# Altium schematic sheet 02_PWR IN.SchDoc (part 1 of 3)
size A3; SheetNumber: 3; SheetTotal: 24
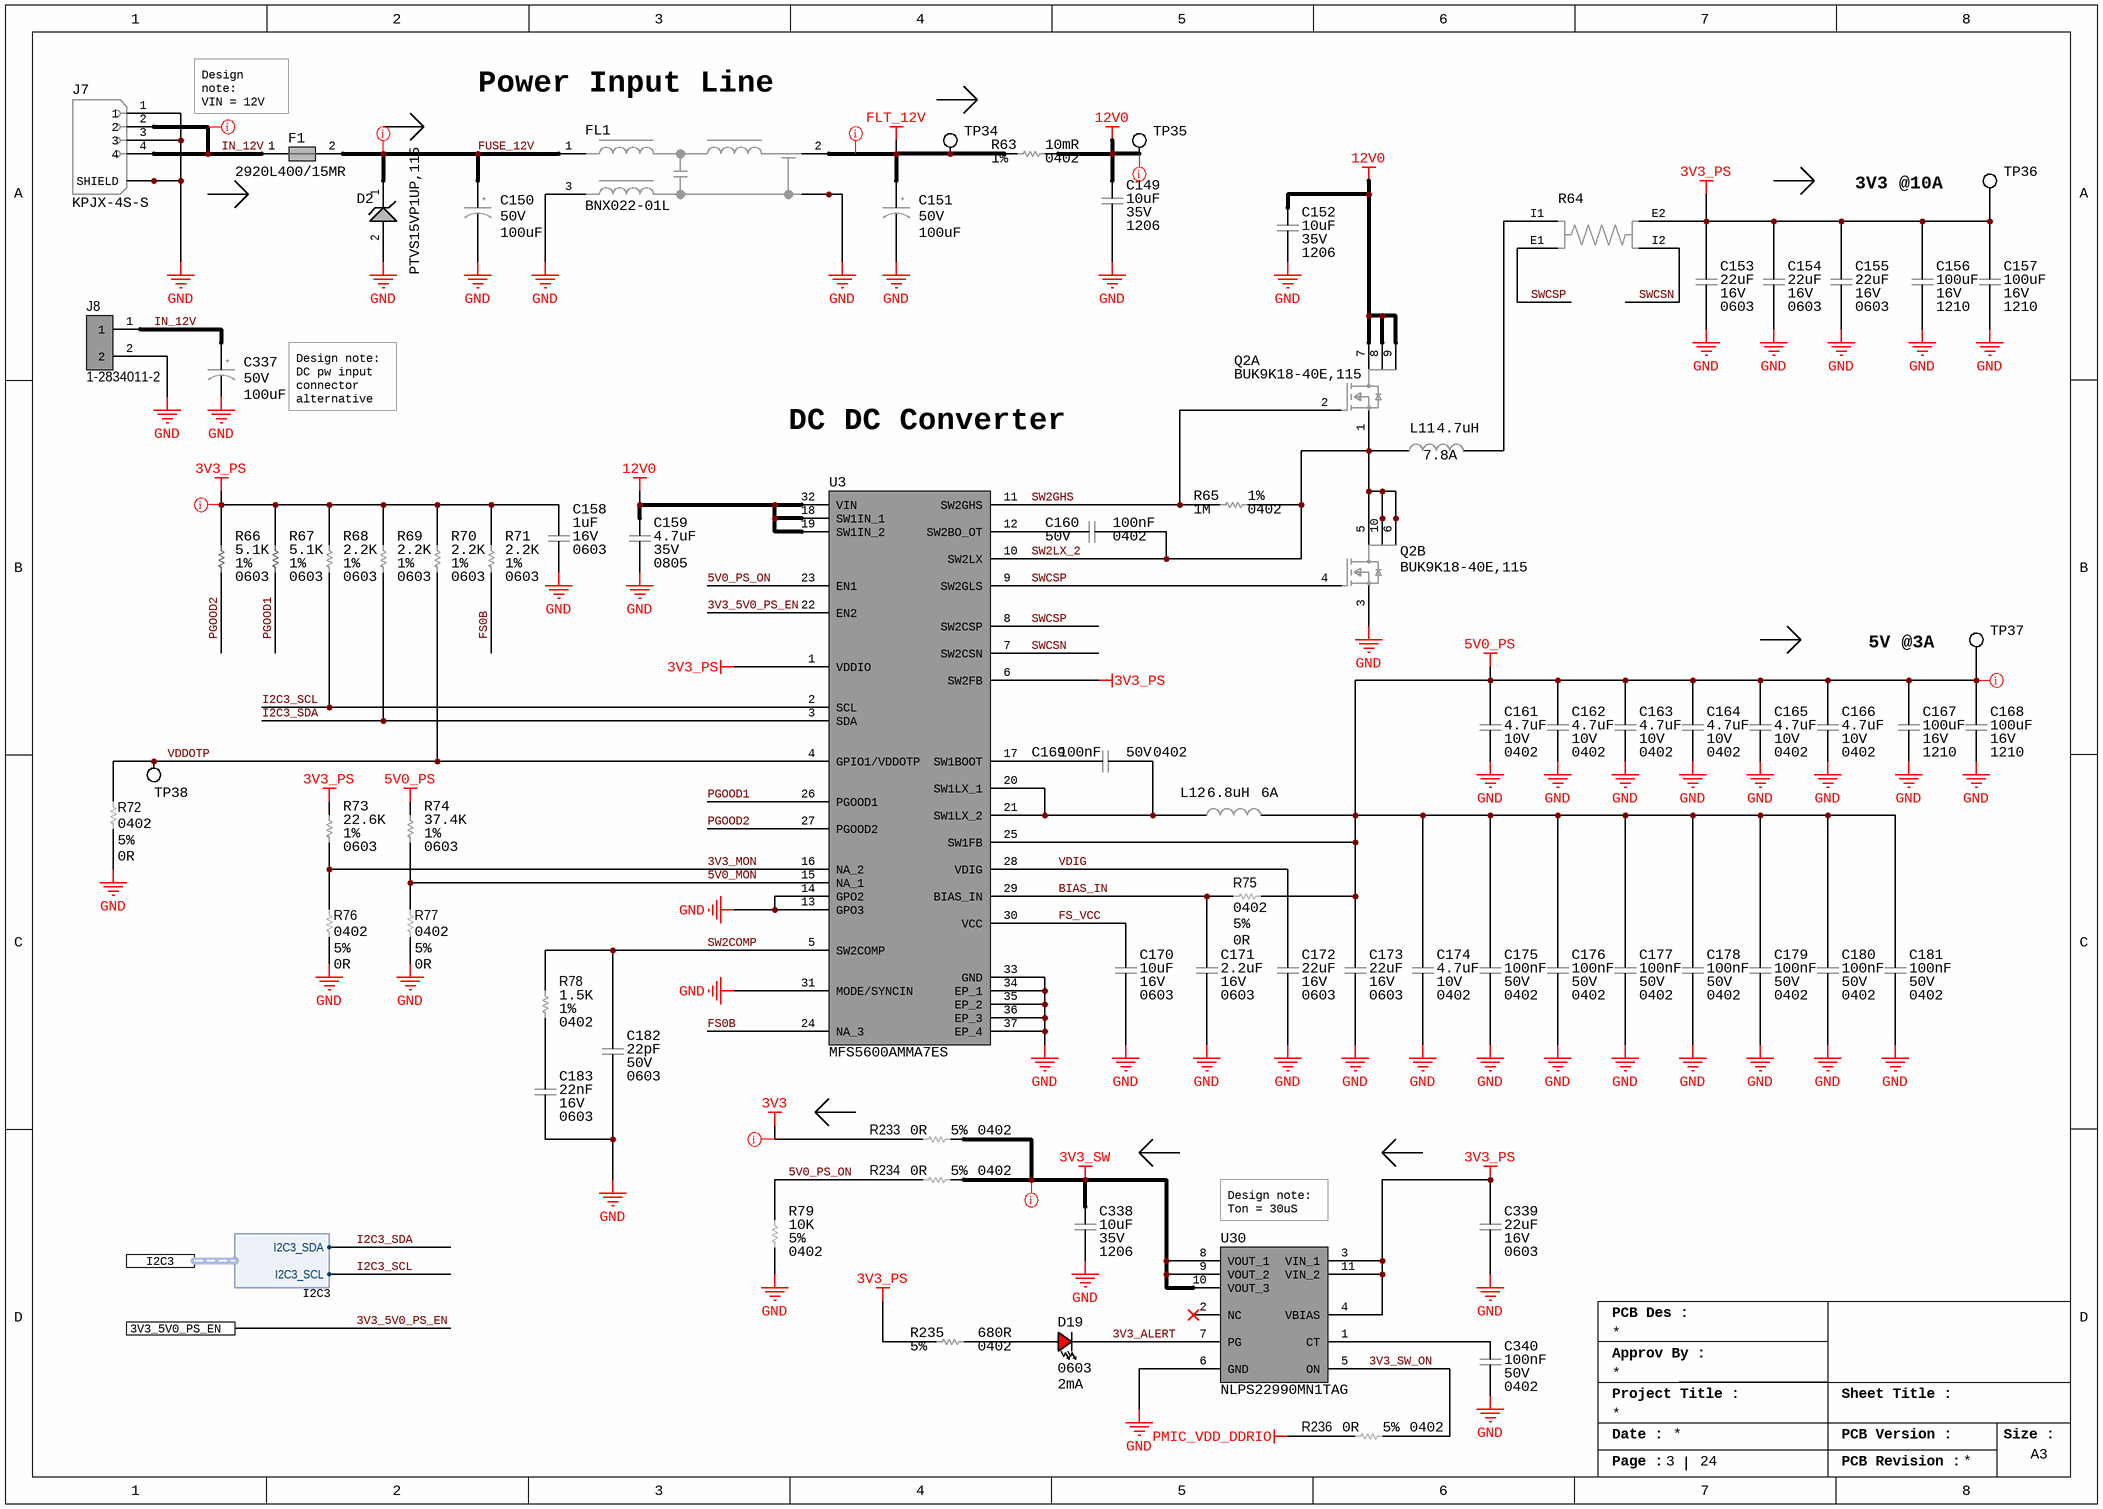
[diagram p0: 02_PWR IN.SchDoc]

## Parts
C149  Voltage Rating: 35V  Capacitance: 10uF  Case/Package: 1206  [CAP_1206_CAPC3216X16N]  (hidden comment: GRM319R6YA106KA12D)
C150  Voltage Rating (DC): 50V  Capacitance: 100uF  [CAP_POLA_UD(8X10)]  (hidden comment: UUD1H101MNL1GS)
C151  Voltage Rating (DC): 50V  Capacitance: 100uF  [CAP_POLA_UD(8X10)]  (hidden comment: UUD1H101MNL1GS)
C152  Voltage Rating: 35V  Capacitance: 10uF  Case/Package: 1206  [CAP_1206_CAPC3216X16N]  (hidden comment: GRM319R6YA106KA12D)
C153  Capacitance: 22uF  Voltage Rating: 16V  Case/Package: 0603  [CAP_0603_CAPC1608X08N]  (hidden comment: CL10A226MO7JZNC)
C154  Capacitance: 22uF  Voltage Rating: 16V  Case/Package: 0603  [CAP_0603_CAPC1608X08N]  (hidden comment: CL10A226MO7JZNC)
C155  Capacitance: 22uF  Voltage Rating: 16V  Case/Package: 0603  [CAP_0603_CAPC1608X08N]  (hidden comment: CL10A226MO7JZNC)
C156  Voltage Rating: 16V  Capacitance: 100uF  Case/Package: 1210  [CAP_1210_CAPC3225X270N]  (hidden comment: EMK325ABJ107MM-T)
C157  Voltage Rating: 16V  Capacitance: 100uF  Case/Package: 1210  [CAP_1210_CAPC3225X270N]  (hidden comment: EMK325ABJ107MM-T)
C158  Voltage Rating: 16V  Capacitance: 1uF  Case/Package: 0603  [CAP_0603_CAPC1608X08N]  (hidden comment: CL10A105KO8NNNC)
C159  Voltage Rating: 35V  Capacitance: 4.7uF  Case/Package: 0805  [CAP_0805_CAPC2012X12N]  (hidden comment: CL21A475KLCLQNC)
C160  Voltage Rating: 50V  Capacitance: 100nF  Case/Package: 0402  [CAP_0402_CAPC1005X05N]  (hidden comment: GRM155R71H104KE14D)
C161  Capacitance: 4.7uF  Voltage Rating: 10V  Case/Package: 0402  [CAP_0402_CAPC1005X05N]  (hidden comment: CL05A475KP5NRNC)
C162  Capacitance: 4.7uF  Voltage Rating: 10V  Case/Package: 0402  [CAP_0402_CAPC1005X05N]  (hidden comment: CL05A475KP5NRNC)
C163  Capacitance: 4.7uF  Voltage Rating: 10V  Case/Package: 0402  [CAP_0402_CAPC1005X05N]  (hidden comment: CL05A475KP5NRNC)
C164  Capacitance: 4.7uF  Voltage Rating: 10V  Case/Package: 0402  [CAP_0402_CAPC1005X05N]  (hidden comment: CL05A475KP5NRNC)
C165  Capacitance: 4.7uF  Voltage Rating: 10V  Case/Package: 0402  [CAP_0402_CAPC1005X05N]  (hidden comment: CL05A475KP5NRNC)
C166  Capacitance: 4.7uF  Voltage Rating: 10V  Case/Package: 0402  [CAP_0402_CAPC1005X05N]  (hidden comment: CL05A475KP5NRNC)
C167  Voltage Rating: 16V  Capacitance: 100uF  Case/Package: 1210  [CAP_1210_CAPC3225X270N]  (hidden comment: EMK325ABJ107MM-T)
C168  Voltage Rating: 16V  Capacitance: 100uF  Case/Package: 1210  [CAP_1210_CAPC3225X270N]  (hidden comment: EMK325ABJ107MM-T)
C169  Voltage Rating: 50V  Capacitance: 100nF  Case/Package: 0402  [CAP_0402_CAPC1005X05N]  (hidden comment: GRM155R71H104KE14D)
C170  Voltage Rating: 16V  Capacitance: 10uF  Case/Package: 0603  [CAP_0603_CAPC1608X08N]  (hidden comment: GRM188R61C106MAALD)
C171  Case/Package: 0603  Capacitance: 2.2uF  Voltage Rating: 16V  [CAP_0603_CAPC1608X08N]  (hidden comment: EMK107BB7225KA-T)
C172  Capacitance: 22uF  Voltage Rating: 16V  Case/Package: 0603  [CAP_0603_CAPC1608X08N]  (hidden comment: CL10A226MO7JZNC)
C173  Capacitance: 22uF  Voltage Rating: 16V  Case/Package: 0603  [CAP_0603_CAPC1608X08N]  (hidden comment: CL10A226MO7JZNC)
C174  Capacitance: 4.7uF  Voltage Rating: 10V  Case/Package: 0402  [CAP_0402_CAPC1005X05N]  (hidden comment: CL05A475KP5NRNC)
C175  Voltage Rating: 50V  Capacitance: 100nF  Case/Package: 0402  [CAP_0402_CAPC1005X05N]  (hidden comment: GRM155R71H104KE14D)
C176  Voltage Rating: 50V  Capacitance: 100nF  Case/Package: 0402  [CAP_0402_CAPC1005X05N]  (hidden comment: GRM155R71H104KE14D)
C177  Voltage Rating: 50V  Capacitance: 100nF  Case/Package: 0402  [CAP_0402_CAPC1005X05N]  (hidden comment: GRM155R71H104KE14D)
C178  Voltage Rating: 50V  Capacitance: 100nF  Case/Package: 0402  [CAP_0402_CAPC1005X05N]  (hidden comment: GRM155R71H104KE14D)
C179  Voltage Rating: 50V  Capacitance: 100nF  Case/Package: 0402  [CAP_0402_CAPC1005X05N]  (hidden comment: GRM155R71H104KE14D)
C180  Voltage Rating: 50V  Capacitance: 100nF  Case/Package: 0402  [CAP_0402_CAPC1005X05N]  (hidden comment: GRM155R71H104KE14D)
C181  Voltage Rating: 50V  Capacitance: 100nF  Case/Package: 0402  [CAP_0402_CAPC1005X05N]  (hidden comment: GRM155R71H104KE14D)
C182  Voltage Rating (DC): 50V  Capacitance: 22pF  Case/Package: 0603  [CAP_0603_CAPC1608X08N]  (hidden comment: C0603C220J5GACTU)
C183  Voltage Rating (DC): 16V  Capacitance: 22nF  Case/Package: 0603  [CAP_0603_CAPC1608X08N]  (hidden comment: C0603C223K4RACTU)
C337  Voltage Rating (DC): 50V  Capacitance: 100uF  [CAP_POLA_UD(8X10)]  (hidden comment: UUD1H101MNL1GS)
C338  Voltage Rating: 35V  Capacitance: 10uF  Case/Package: 1206  [CAP_1206_CAPC3216X16N]  (hidden comment: GRM319R6YA106KA12D)
C339  Capacitance: 22uF  Voltage Rating: 16V  Case/Package: 0603  [CAP_0603_CAPC1608X08N]  (hidden comment: CL10A226MO7JZNC)
C340  Voltage Rating: 50V  Capacitance: 100nF  Case/Package: 0402  [CAP_0402_CAPC1005X05N]  (hidden comment: GRM155R71H104KE14D)
D2  PTVS15VP1UP,115  [PMEG3050EP115]
D19  Case/Package: 0603  Test Current: 2mA  [LED_0603-RED-0.75mm]  (hidden comment: LTST-C193KRKT-2A)
F1  2920L400/15MR  [2920L07560MR]
FL1  BNX022-01L  [FILTER_BNX022-01L]
J7  KPJX-4S-S  [CONN_DC_KYCON_KPJX-4S-S]
J8  1-2834011-2  [CONN_TBLOCK_128340112]
L11  Current Rating: 7.8A  Inductance: 4.7uH  [SPM7054VT]  (hidden comment: SPM7054VT-4R7M-D)
L12  Max DC Current: 6A  Inductance: 6.8uH  [WE-LHMI_104048]  (hidden comment: 74437368068)
Q2  BUK9K18-40E,115  [BUK9K1840E115]  (parts A,B of 2)
R63  Tolerance: 1%  Resistance: 10mR  Case/Package: 0402  [RES_0603_RESC1608X04N]  (hidden comment: ERJ-2LWFR010X)
R64  WSK2512R0100FEA  [RES_WSK2512R0100FEA]  (value not drawn)
R65  Resistance: 1M  Tolerance: 1%  Case/Package: 0402  [RES_0402_RESC1005X04N]  (hidden comment: CR0402-FX-1004GLF)
R66  Tolerance: 1%  Resistance: 5.1K  Case/Package: 0603  [RES_0603_RESC1608X04N]  (hidden comment: RC0603FR-075K1L)
R67  Tolerance: 1%  Resistance: 5.1K  Case/Package: 0603  [RES_0603_RESC1608X04N]  (hidden comment: RC0603FR-075K1L)
R68  Tolerance: 1%  Resistance: 2.2K  Case/Package: 0603  [RES_0603_RESC1608X04N]  (hidden comment: RC0603FR-072K2L)
R69  Tolerance: 1%  Resistance: 2.2K  Case/Package: 0603  [RES_0603_RESC1608X04N]  (hidden comment: RC0603FR-072K2L)
R70  Tolerance: 1%  Resistance: 2.2K  Case/Package: 0603  [RES_0603_RESC1608X04N]  (hidden comment: RC0603FR-072K2L)
R71  Tolerance: 1%  Resistance: 2.2K  Case/Package: 0603  [RES_0603_RESC1608X04N]  (hidden comment: RC0603FR-072K2L)
R72  Case Code (Imperial): 0402  Tolerance: 5%  Resistance: 0R  [RES_0402_RESC1005X04N]  (hidden comment: ERJ-2GE0R00X)
R73  Tolerance: 1%  Resistance: 22.6K  Case/Package: 0603  [RES_0603_RESC1608X04N]  (hidden comment: AC0603FR-0722K6L)
R74  Tolerance: 1%  Resistance: 37.4K  Case/Package: 0603  [RES_0603_RESC1608X04N]  (hidden comment: RC0603FR-0737K4L)
R75  Case Code (Imperial): 0402  Tolerance: 5%  Resistance: 0R  [RES_0402_RESC1005X04N]  (hidden comment: ERJ-2GE0R00X)
R76  Case Code (Imperial): 0402  Tolerance: 5%  Resistance: 0R  [RES_0402_RESC1005X04N]  (hidden comment: ERJ-2GE0R00X)
R77  Case Code (Imperial): 0402  Tolerance: 5%  Resistance: 0R  [RES_0402_RESC1005X04N]  (hidden comment: ERJ-2GE0R00X)
R78  Resistance: 1.5K  Tolerance: 1%  Case/Package: 0402  [RES_0402_RESC1005X04N]  (hidden comment: CR0402-FX-1501GLF)
R79  Tolerance: 5%  Resistance: 10K  Case/Package: 0402  [RES_0402_RESC1005X04N]  (hidden comment: ERJ-2GEJ103X)
R233  Case Code (Imperial): 0402  Tolerance: 5%  Resistance: 0R  [RES_0402_RESC1005X04N]  (hidden comment: ERJ-2GE0R00X)
R234  Case Code (Imperial): 0402  Tolerance: 5%  Resistance: 0R  [RES_0402_RESC1005X04N]  (hidden comment: ERJ-2GE0R00X)
R235  Tolerance: 5%  Resistance: 680R  Case/Package: 0402  [RES_0402_RESC1005X04N]  (hidden comment: ERJ-2GEJ681X)
R236  Case Code (Imperial): 0402  Tolerance: 5%  Resistance: 0R  [RES_0402_RESC1005X04N]  (hidden comment: ERJ-2GE0R00X)
TP34  NO COMPONENT  [TP_PAD_0.5MM_SMD_ROUND]  (value not drawn)  (no BOM)
TP35  NO COMPONENT  [TP_PAD_0.5MM_SMD_ROUND]  (value not drawn)  (no BOM)
TP36  NO COMPONENT  [TP_PAD_0.5MM_SMD_ROUND]  (value not drawn)  (no BOM)
TP37  NO COMPONENT  [TP_PAD_0.5MM_SMD_ROUND]  (value not drawn)  (no BOM)
TP38  NO COMPONENT  [TP_PAD_0.5MM_SMD_ROUND]  (value not drawn)  (no BOM)
U3  MFS5600AMMA7ES  [MFS5600AMMA7ES]
U30  NLPS22990MN1TAG  [SON50P200X300X80-11N]

## Ports
3V3_5V0_PS_EN, I2C3 (harness I2C3)

## Harnesses
I2C3: I2C3_SDA, I2C3_SCL

## Nets
3V3: R233.2
3V3_PS: C153.2 C154.2 C155.2 C156.2 C157.2 C158.2 C339.2 R64.E2 R66.2 R67.2 R68.2 R69.2 R70.2 R71.2 R73.2 R235.1 TP36.1 U3.1(VDDIO) U3.6(SW2FB) U30.3(VIN_1) U30.4(VBIAS) U30.11(VIN_2)
3V3_SW: C338.2 R233.1 R234.1 U30.8(VOUT_1) U30.9(VOUT_2) U30.10(VOUT_3)
5V0_PS: C161.2 C162.2 C163.2 C164.2 C165.2 C166.2 C167.2 C168.2 C173.2 C174.2 C175.2 C176.2 C177.2 C178.2 C179.2 C180.2 C181.2 L12.2 R74.2 R75.1 TP37.1 U3.25(SW1FB)
12V0: C149.2 C152.2 C159.2 Q2.7(D1_1) Q2.8(D1_2) Q2.9(D1_3) R63.2 TP35.1 U3.18(SW1IN_1) U3.19(SW1IN_2) U3.32(VIN)
FLT_12V: C151.1 FL1.2(CB) R63.1 TP34.1
GND: C149.1 C150.2 C151.2 C152.1 C153.1 C154.1 C155.1 C156.1 C157.1 C158.1 C159.1 C161.1 C162.1 C163.1 C164.1 C165.1 C166.1 C167.1 C168.1 C170.1 C171.1 C172.1 C173.1 C174.1 C175.1 C176.1 C177.1 C178.1 C179.1 C180.1 C181.1 C182.1 C183.1 C337.2 C338.1 C339.1 C340.1 D2.2(A) FL1.3(PSG) FL1.4(CG) FL1.5(CG) FL1.6(CG) J7.1 J7.3 J7.S1(SHIELD) J7.S2(SHIELD) J7.S3(SHIELD) J8.2 Q2.3(S2) R72.1 R76.1 R77.1 R79.2 U3.13(GPO3) U3.14(GPO2) U3.31(MODE/SYNCIN) U3.33(GND) U3.34(EP_1) U3.35(EP_2) U3.36(EP_3) U3.37(EP_4) U30.6(GND)
PMIC_VDD_DDRIO: R236.2
3V3_5V0_PS_EN: U3.22(EN2) ; port 3V3_5V0_PS_EN
3V3_ALERT: D19.1(C) U30.7(PG)
3V3_MON: R73.1 R76.2 U3.16(NA_2)
3V3_SW_ON: R236.1 U30.5(ON)
5V0_MON: R74.1 R77.2 U3.15(NA_1)
5V0_PS_ON: R79.1 R234.2 U3.23(EN1)
BIAS_IN: C171.2 R75.2 U3.29(BIAS_IN)
FS0B: R71.1 U3.24(NA_3)
FS_VCC: C170.2 U3.30(VCC)
FUSE_12V: C150.1 D2.1(K) F1.2 FL1.1(B)
I2C3_SCL: R68.1 U3.2(SCL) ; port I2C3.I2C3_SCL
I2C3_SDA: R69.1 U3.3(SDA) ; port I2C3.I2C3_SDA
IN_12V: C337.1 F1.1 J7.2 J7.4 J8.1
PGOOD1: R67.1 U3.26(PGOOD1)
PGOOD2: R66.1 U3.27(PGOOD2)
SW2COMP: C182.2 R78.2 U3.5(SW2COMP)
SW2GHS: Q2.2(G1) R65.1 U3.11(SW2GHS)
SW2LX_2: C160.1 L11.1 Q2.1(S1) Q2.5(D2_1) Q2.6(D2_2) Q2.10(D2_3) R65.2 U3.10(SW2LX)
SWCSN: R64.I2 U3.7(SW2CSN)
SWCSP: Q2.4(G2) R64.E1 U3.8(SW2CSP) U3.9(SW2GLS)
VDDOTP: R70.1 R72.2 TP38.1 U3.4(GPIO1/VDDOTP)
VDIG: C172.2 U3.28(VDIG)
NetC160_2: C160.2 U3.12(SW2BO_OT)
NetC169_1: C169.1 U3.17(SW1BOOT)
NetC169_2: C169.2 L12.1 U3.20(SW1LX_1) U3.21(SW1LX_2)
NetC183_2: C183.2 R78.1
NetC340_2: C340.2 U30.1(CT)
NetD19_2: D19.2(A) R235.2
NetL11_2: L11.2 R64.I1

Not connected (* = marked no-connect by the designer): U30 2(NC)*

## Layout directives
net class PWR: 3V3, 3V3_PS, 3V3_SW, 5V0_PS, 12V0, FLT_12V, FUSE_12V, IN_12V

## Notes on the sheet
- (near F1) Design note:
  VIN = 12V
  Imax = 8A
- Power Input Line
- 3V3 @10A
- Design note:
  DC pw input connector alternative
- DC DC Converter
- 5V @3A
- (near U30) Design note:
  Ton = 30uS
- PCB Des :
- Approv By :
- Project Title :
- Sheet Title :
- Date :
- PCB Version :
- Size :
- A3
- Page :
- PCB Revision :
- (in symbol CAP_100UF_50V_POL) +